# Altium schematic sheet header_conn.SchDoc
size A4; SheetNumber: 3; SheetTotal: 5
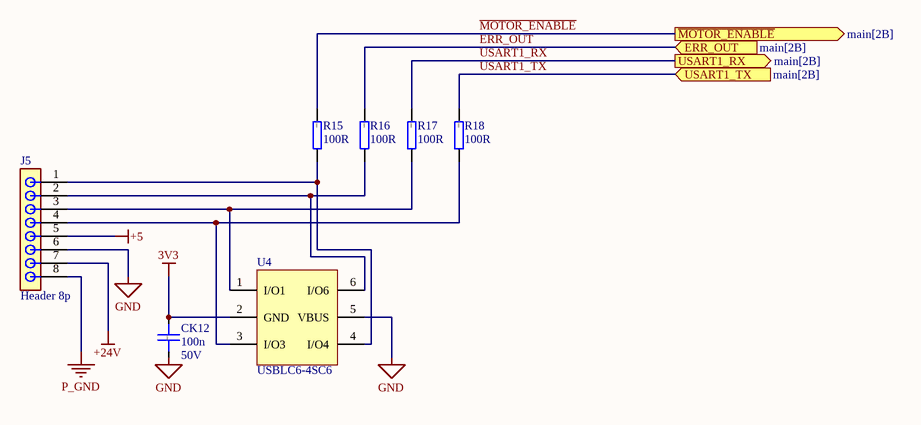
[diagram p0: header_conn.SchDoc]

## Parts
CK12  100n  Voltage rating: 50V  [CAP0603]
J5  Header 8p  [Pin header 8p]
R15  100R  [RESC2012X06N(SMR0805)]
R16  100R  [RESC2012X06N(SMR0805)]
R17  100R  [RESC2012X06N(SMR0805)]
R18  100R  [RESC2012X06N(SMR0805)]
U4  USBLC6-4SC6  [SOT23-6]

## Ports
ERR_OUT (in, see main[2B]), USART1_RX (out, see main[2B]), USART1_TX (in, see main[2B]), ~{MOTOR_ENABLE} (out, see main[2B])

## Nets
3V3: CK12.1 U4.2(GND)
+5: J5.5
+24V: J5.7
GND: CK12.2 J5.6 U4.5(VBUS)
P_GND: J5.8
~{MOTOR_ENABLE}: R15.2 ; port ~{MOTOR_ENABLE}
ERR_OUT: R16.2 ; port ERR_OUT
USART1_RX: R17.2 ; port USART1_RX
USART1_TX: R18.2 ; port USART1_TX
NetJ5_1: J5.1 R15.1 U4.4(I/O4)
NetJ5_2: J5.2 R16.1 U4.6(I/O6)
NetJ5_3: J5.3 R17.1 U4.1(I/O1)
NetJ5_4: J5.4 R18.1 U4.3(I/O3)

## Notes on the sheet
- (in symbol Cap 100n 0603) 0603

## Library data of the parts
CK12 = Cap 100n 0603: 50V 100nF X7R ±10% 0603 Multilayer Ceramic Capacitors MLCC - SMD/SMT ROHS; Basic: Yes; Value: 100n; JLCPCB Part: C14663
J5 = Pin header 8p: 3A Direct Insert Policy 6P -40℃~+105℃ 2.54mm Single Row Black Brass 1x6P Plugin,P=2.54mm Pin Headers ROHS; Manufacturer_Name: Connfly; Manufacturer_Part_Number: DS1021-1*2SF11-B; Datasheet Link: https://www.tme.com/Document/cc301e58a5da78cb543a94b5a5b7f06a/DS1021.pdf; Height: 5.88mm; JLCPCB Part: C37208
R15-R18 = Res 100R 0805: 125mW Thick Film Resistors 150V ±100ppm/℃ ±1% 100Ω 0805 Chip Resistor - Surface Mount ROHS; Tolerance & Rating: 1%/0.1W; Basic: Yes; Value: 100R; Package: 0805; Author: JP/27.03.2014; SMD: 1; ComponentLink3Description: rezistor čip; ComponentLink3URL: heliosgreen://v1/hegMT/5-MT/Classes(343)/Folders/OpenForm?RecordNumbers=[381513]; JLCPCB Part: C17408
U4 = USBLC6-4SC6: 5A 17V 6V Unidirectional 5.25V SOT-23-6 ESD and Surge Protection (TVS/ESD) ROHS; Basic: No; JLCPCB Part: C111212; TME Part: USBLC6-4SC6